# Altium schematic sheet Part_1_Main.SchDoc
size 431 x 279 mm; SheetNumber: 1; SheetTotal: 2
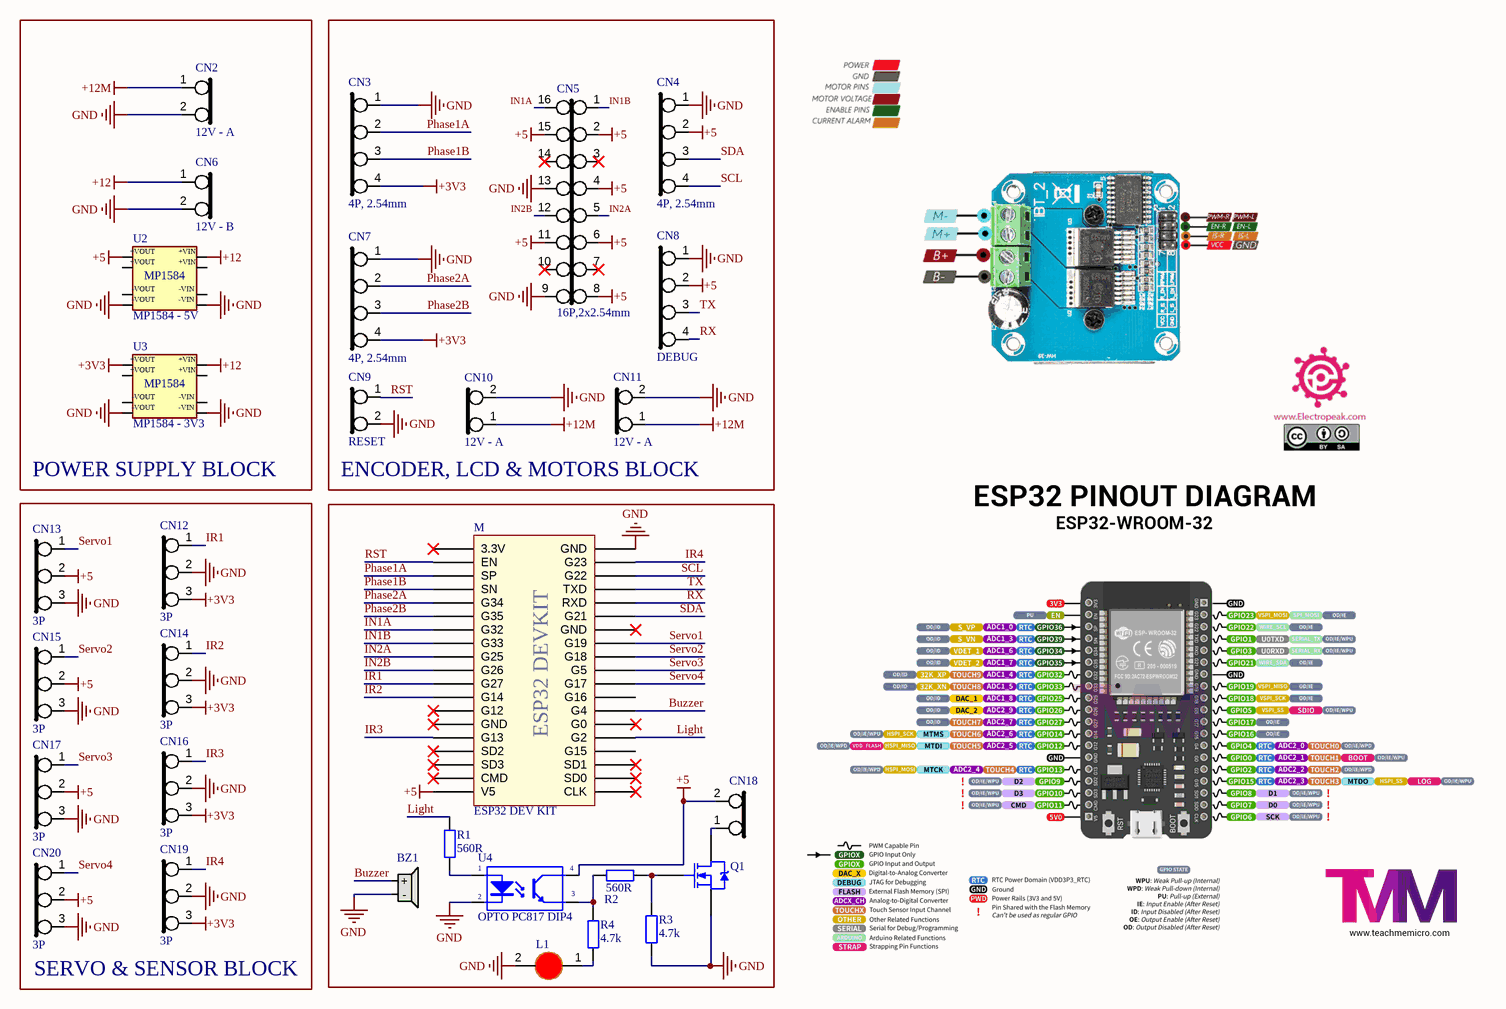
[diagram p0: Part_1_Main.SchDoc]

## Parts
BZ1  Buzzer_DIP 1209  [BUZZER 1209]  (value not drawn)
CN2  4.Value: 12V - A  [KF2EDGK-5.08-2P H]  (hidden comment: CN_2P_KF2EDGK Right Angle)
CN3  4.Value: 4P, 2.54mm  [B4B-XH-A]  (hidden comment: CN_4P_XH2.54)
CN4  4.Value: 4P, 2.54mm  [B4B-XH-A]  (hidden comment: CN_4P_XH2.54)
CN5  4.Value: 16P,2x2.54mm  [DC3 16P-2.54]  (hidden comment: CN_16P_DC3-2.54_B)
CN6  4.Value: 12V - B  [KF2EDGK-5.08-2P H]  (hidden comment: CN_2P_KF2EDGK Right Angle)
CN7  4.Value: 4P, 2.54mm  [B4B-XH-A]  (hidden comment: CN_4P_XH2.54)
CN8  4.Value: DEBUG  [B4B-XH-A]  (hidden comment: CN_4P_XH2.54)
CN9  4.Value: RESET  [B2B-XH-A]  (hidden comment: CN_2P_XH2.54)
CN10  4.Value: 12V - A  [KF2EDGK-5.08-2P H]  (hidden comment: CN_2P_KF2EDGK Right Angle)
CN11  4.Value: 12V - A  [KF2EDGK-5.08-2P H]  (hidden comment: CN_2P_KF2EDGK Right Angle)
CN12  4.Value: 3P  [B3B-XH-A]  (hidden comment: CN_3P_XH2.54)
CN13  4.Value: 3P  [B3B-XH-A]  (hidden comment: CN_3P_XH2.54)
CN14  4.Value: 3P  [B3B-XH-A]  (hidden comment: CN_3P_XH2.54)
CN15  4.Value: 3P  [B3B-XH-A]  (hidden comment: CN_3P_XH2.54)
CN16  4.Value: 3P  [B3B-XH-A]  (hidden comment: CN_3P_XH2.54)
CN17  4.Value: 3P  [B3B-XH-A]  (hidden comment: CN_3P_XH2.54)
CN18  CN_2P_KF2EDGK Vertical  [KF2EDGK-5.08-2P V]  (value not drawn)
CN19  4.Value: 3P  [B3B-XH-A]  (hidden comment: CN_3P_XH2.54)
CN20  4.Value: 3P  [B3B-XH-A]  (hidden comment: CN_3P_XH2.54)
L1  LED 0805  [LED-0805-Red]  (value not drawn)
M  ESP32 DEV KIT  [ESP32 DEVKIT]
Q1  IRFZ44  [TO220]  (value not drawn)
R1  560R  [tro vach 1/4w]
R2  560R  [tro vach 1/4w]
R3  4.7k  [tro vach 1/4w]
R4  4.7k  [tro vach 1/4w]
U2  MP1584 - 5V  [MP1584]
U3  MP1584 - 3V3  [MP1584]
U4  OPTO PC817 DIP4  [DIP4]

## Blocks framed on the sheet
POWER SUPPLY BLOCK: CN2 CN6 U2 U3
ENCODER, LCD & MOTORS BLOCK: CN3-CN5 CN7-CN11
SERVO & SENSOR BLOCK: CN12-CN17 CN19 CN20

## Nets
+3V3: CN3.4 CN7.4 CN12.3 CN14.3 CN16.3 CN19.3 U3.+VOUT
+5: CN4.2 CN5.2 CN5.4 CN5.6 CN5.8 CN5.11 CN5.15 CN8.2 CN13.2 CN15.2 CN17.2 CN18.2 CN20.2 M.19(V5) U2.+VOUT U4.4(C)
+12: CN6.1 U2.+VIN U3.+VIN
+12M: CN2.1 CN10.1 CN11.1
GND: BZ1.2(-) CN2.2 CN3.1 CN4.1 CN5.9 CN5.13 CN6.2 CN7.1 CN8.1 CN9.2 CN10.2 CN11.2 CN12.2 CN13.3 CN14.2 CN15.3 CN16.2 CN17.3 CN19.2 CN20.3 L1.2(K) M.38(GND) Q1.3(S) R3.1 U2.-VIN U2.-VOUT U3.-VIN U3.-VOUT U4.2(K)
Buzzer: BZ1.1(+) M.26(G4)
IN1A: CN5.16 M.7(G32)
IN1B: CN5.1 M.8(G33)
IN2A: CN5.5 M.9(G25)
IN2B: CN5.12 M.10(G26)
IR1: CN12.1 M.11(G27)
IR2: CN14.1 M.12(G14)
IR3: CN16.1 M.15(G13)
IR4: CN19.1 M.37(G23)
Light: M.24(G2) R1.2
Phase1A: CN3.2 M.3(SP)
Phase1B: CN3.3 M.4(SN)
Phase2A: CN7.2 M.5(G34)
Phase2B: CN7.3 M.6(G35)
RST: CN9.1 M.2(EN)
RX: CN8.4 M.34(RXD)
SCL: CN4.4 M.36(G22)
SDA: CN4.3 M.33(G21)
Servo1: CN13.1 M.31(G19)
Servo2: CN15.1 M.30(G18)
Servo3: CN17.1 M.29(G5)
Servo4: CN20.1 M.28(G17)
TX: CN8.3 M.35(TXD)
NetCN18_1: CN18.1 Q1.2(D)
NetL1_1: L1.1(A) R4.1
NetQ1_1: Q1.1(G) R2.2 R3.2
NetR1_1: R1.1 U4.1(A)
NetR2_1: R2.1 R4.2 U4.3(E)

Not connected (* = marked no-connect by the designer): CN5 3(4)* 7(12)* 10(18)* 14(26)*; M 1(3.3V)* 13(G12)* 14(GND)* 16(SD2)* 17(SD3)* 18(CMD)* 20(CLK)* 21(SD0)* 22(SD1)* 23(G15) 25(G0)* 27(G16) 32(GND)*

## Notes on the sheet
- DWG. NO.
- REV.
- SHT.
- THIS DOCUMENT AND THE DATA DISCLOSED HEREIN OR HEREWITH IS THE PROPERTY OF ALTIUM LIMITED AND MAY BE FREELY DISTRIBUTED IN WHOLE. NO RIGHTS ARE RESERVED OR EXPRESS OR IMPLIED WARANTEE GIVEN.
- REVISION
- DESCRIPTION
- DATE
- APPROVED
- ENG:
- APPROVALS
- PROJECT
- DSN:
- CHK:
- REFERENCE DOCUMENTS
- PROJECT REVISION:
- TITLE
- DOCUMENT REVISION:
- DESIGN ITEM:
- BOM:
- FAB DWG:
- PCB DWG:
- ASSY DWG:
- SCALE:
- SIZE
- B
- CAGE CODE
- FILE NAME
- DWG NO.
- SHEET
- OF
- REV
- (in symbol ESP32 DEV KIT) ESP32 DEVKIT

## Library data of the parts
BZ1 = Buzzer_DIP 1209: Buzzer; 3.Part Name: 1209 DIP Buzzer; 0.Part Code: TF#54600700; 1.Type: Through Hole; 4.Value: 93dB; 2.Category: Buzzer
CN2 CN6 CN10 CN11 = CN_2P_KF2EDGK Right Angle: Terminal 2Pin, Pitch 5.08mm, Right Angle; 3.Part Name: KF2EDGK-5.08-2P-Right Angle; 1.Type: Through Hole; 2.Category: Terminal; 0.Part Code: *
CN3 CN4 CN7 CN8 = CN_4P_XH2.54: Male XH Connector 4Pins_Female (XHP-4); 0.Part Code: TF#55101900; 1.Type: Through Hole; 2.Category: Connector; 3.Part Name: B4B-XH-A
CN5 = CN_16P_DC3-2.54_B: DC3 Male Connector 16P 2.54mm_Female (FC-16P-2.54mm); 0.Part Code: TF#55100600; 3.Part Name: DC3 16Pin-2.54mm; 1.Type: Through Hole; 2.Category: Connector
CN9 = CN_2P_XH2.54: XH Connector 2Pins_Female (XHP-2); 1.Type: Through Hole; 2.Category: Connector; 0.Part Code: *; 3.Part Name: B2B-XH-A
CN12-CN17 CN19 CN20 = CN_3P_XH2.54: Male XH Connector 3Pins_Female (XHP-3); 0.Part Code: TF#55100400; 1.Type: Through Hole; 2.Category: Connector; 3.Part Name: B3B-XH-A
CN18 = CN_2P_KF2EDGK Vertical: Terminal 2Pins, Pitch 5.08mm, Vertical; 0.Part Code: TF#56000900; 3.Part Name: KF2EDGK-5.08-2P-Vertical; 1.Type: Through Hole; 4.Value: 2P, 5.08mm; 2.Category: Terminal
L1 = LED 0805 Do: Dán; Don_Vi: Con; Ma_Hang: MH000897; Ten_Linh_Kien: LED 0805 Màu Đỏ (Red); Ghi_Chu: *; Kieu_Chan: *; Chung_Loai: Dán
Q1 = FET IRFZ44 DIP: TO-220
R1 R2 = Tro Vach 1/4W 5% 560R: Cắm; Ten_Linh_Kien: Trở Vạch 1/4w 5% 560R; Don_Vi: Con; So_Chan: 2; Ma_Hang: MH007328; Chung_Loai: Cắm; Kieu_Chan: *
R3 R4 = Tro Vach 1/4W 5% 4.7k: Cắm; Don_Vi: Con; So_Chan: 2; Ten_Linh_Kien: Trở Vạch 1/4w 5% 4.7k; Ma_Hang: MH007317; Chung_Loai: Cắm; Kieu_Chan: *
U2 U3 = MP1584
U4 = OPTO PC817 DIP4: Single Opto; Value: PC817